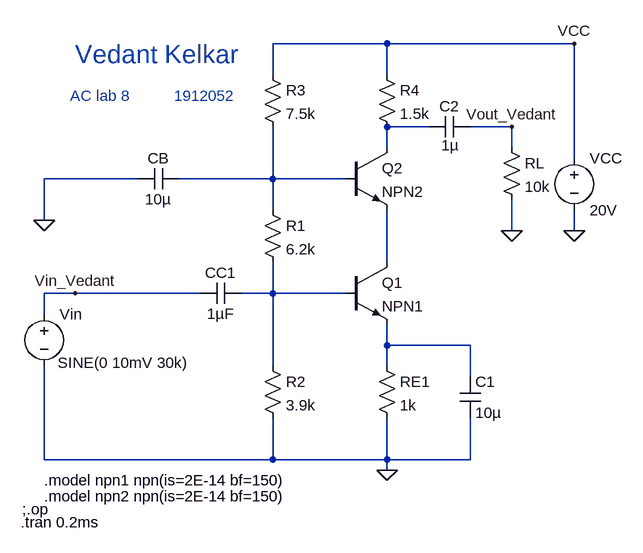
[diagram p0: schematic Draft42.asc]
Draft42.asc, the LTspice schematic file:
Version 4
SHEET 1 880 680
WIRE 336 -224 160 -224
WIRE 624 -224 336 -224
WIRE 160 -176 160 -224
WIRE 336 -176 336 -224
WIRE 400 -96 336 -96
WIRE 528 -96 464 -96
WIRE 336 -64 336 -96
WIRE 528 -64 528 -96
WIRE 624 -48 624 -224
WIRE -48 -16 -192 -16
WIRE 160 -16 160 -96
WIRE 160 -16 16 -16
WIRE 272 -16 160 -16
WIRE 160 32 160 -16
WIRE -192 48 -192 -16
WIRE 528 64 528 16
WIRE 624 64 624 32
WIRE 336 112 336 32
WIRE -144 160 -192 160
WIRE 48 160 -144 160
WIRE 160 160 160 112
WIRE 160 160 112 160
WIRE 272 160 160 160
WIRE -192 192 -192 160
WIRE 336 240 336 208
WIRE 464 240 336 240
WIRE 160 272 160 160
WIRE 336 272 336 240
WIRE 464 288 464 240
WIRE -192 416 -192 272
WIRE 160 416 160 352
WIRE 160 416 -192 416
WIRE 336 416 336 352
WIRE 336 416 160 416
WIRE 464 416 464 352
WIRE 464 416 336 416
WIRE 336 432 336 416
FLAG 336 432 0
FLAG -144 160 Vin_Vedant
FLAG 528 64 0
FLAG 624 64 0
FLAG -192 48 0
FLAG 528 -96 Vout_Vedant
FLAG 624 -224 VCC
SYMBOL res 144 16 R0
SYMATTR InstName R1
SYMATTR Value 6.2k
SYMBOL res 320 256 R0
SYMATTR InstName RE1
SYMATTR Value 1k
SYMBOL res 144 256 R0
SYMATTR InstName R2
SYMATTR Value 3.9k
SYMBOL cap 112 144 R90
WINDOW 0 0 32 VBottom 2
WINDOW 3 32 32 VTop 2
SYMATTR InstName CC1
SYMATTR Value 1µF
SYMBOL voltage -192 176 R0
WINDOW 123 22 92 Left 2
WINDOW 39 0 0 Left 0
WINDOW 3 21 91 Left 2
SYMATTR Value SINE(0 10mV 30k)
SYMATTR InstName Vin
SYMBOL npn 272 112 R0
SYMATTR InstName Q1
SYMATTR Value NPN1
SYMBOL cap 448 288 R0
SYMATTR InstName C1
SYMATTR Value 10µ
SYMBOL npn 272 -64 R0
SYMATTR InstName Q2
SYMATTR Value NPN2
SYMBOL res 144 -192 R0
SYMATTR InstName R3
SYMATTR Value 7.5k
SYMBOL res 320 -192 R0
SYMATTR InstName R4
SYMATTR Value 1.5k
SYMBOL cap 464 -112 R90
WINDOW 0 0 32 VBottom 2
WINDOW 3 29 31 VTop 2
SYMATTR InstName C2
SYMATTR Value 1µ
SYMBOL res 512 -80 R0
SYMATTR InstName RL
SYMATTR Value 10k
SYMBOL voltage 624 -64 R0
WINDOW 123 0 0 Left 0
WINDOW 39 0 0 Left 0
SYMATTR InstName VCC
SYMATTR Value 20V
SYMBOL cap 16 -32 R90
WINDOW 0 0 32 VBottom 2
WINDOW 3 32 32 VTop 2
SYMATTR InstName CB
SYMATTR Value 10µ
TEXT -144 -208 Left 4 ;Vedant Kelkar
TEXT -152 -144 Left 2 ;AC lab 8
TEXT 8 -144 Left 2 ;1912052
TEXT -192 448 Left 2 !.model npn1 npn(is=2E-14 bf=150)
TEXT -192 472 Left 2 !.model npn2 npn(is=2E-14 bf=150)
TEXT -226 492 Left 2 !;.op
TEXT -228 512 Left 2 !.tran 0.2ms

The netlist it stands for:
* Draft42.asc
R1 N002 N004 6.2k
RE1 N005 0 1k
R2 N004 0 3.9k
CC1 N004 Vin_Vedant 1µF
Vin Vin_Vedant 0 SINE(0 10mV 30k)
Q1 N003 N004 N005 0 NPN1
C1 N005 0 10µ
Q2 N001 N002 N003 0 NPN2
R3 VCC N002 7.5k
R4 VCC N001 1.5k
C2 Vout_Vedant N001 1µ
RL Vout_Vedant 0 10k
VCC VCC 0 20V
CB N002 0 10µ
.model NPN NPN
.model PNP PNP
.lib standard.bjt
* Vedant Kelkar
* AC lab 8
* 1912052
.model npn1 npn(is=2E-14 bf=150)
.model npn2 npn(is=2E-14 bf=150)
;.op
.tran 0.2ms
.backanno
.end